# Altium schematic sheet Osiris.SchDoc
size A3
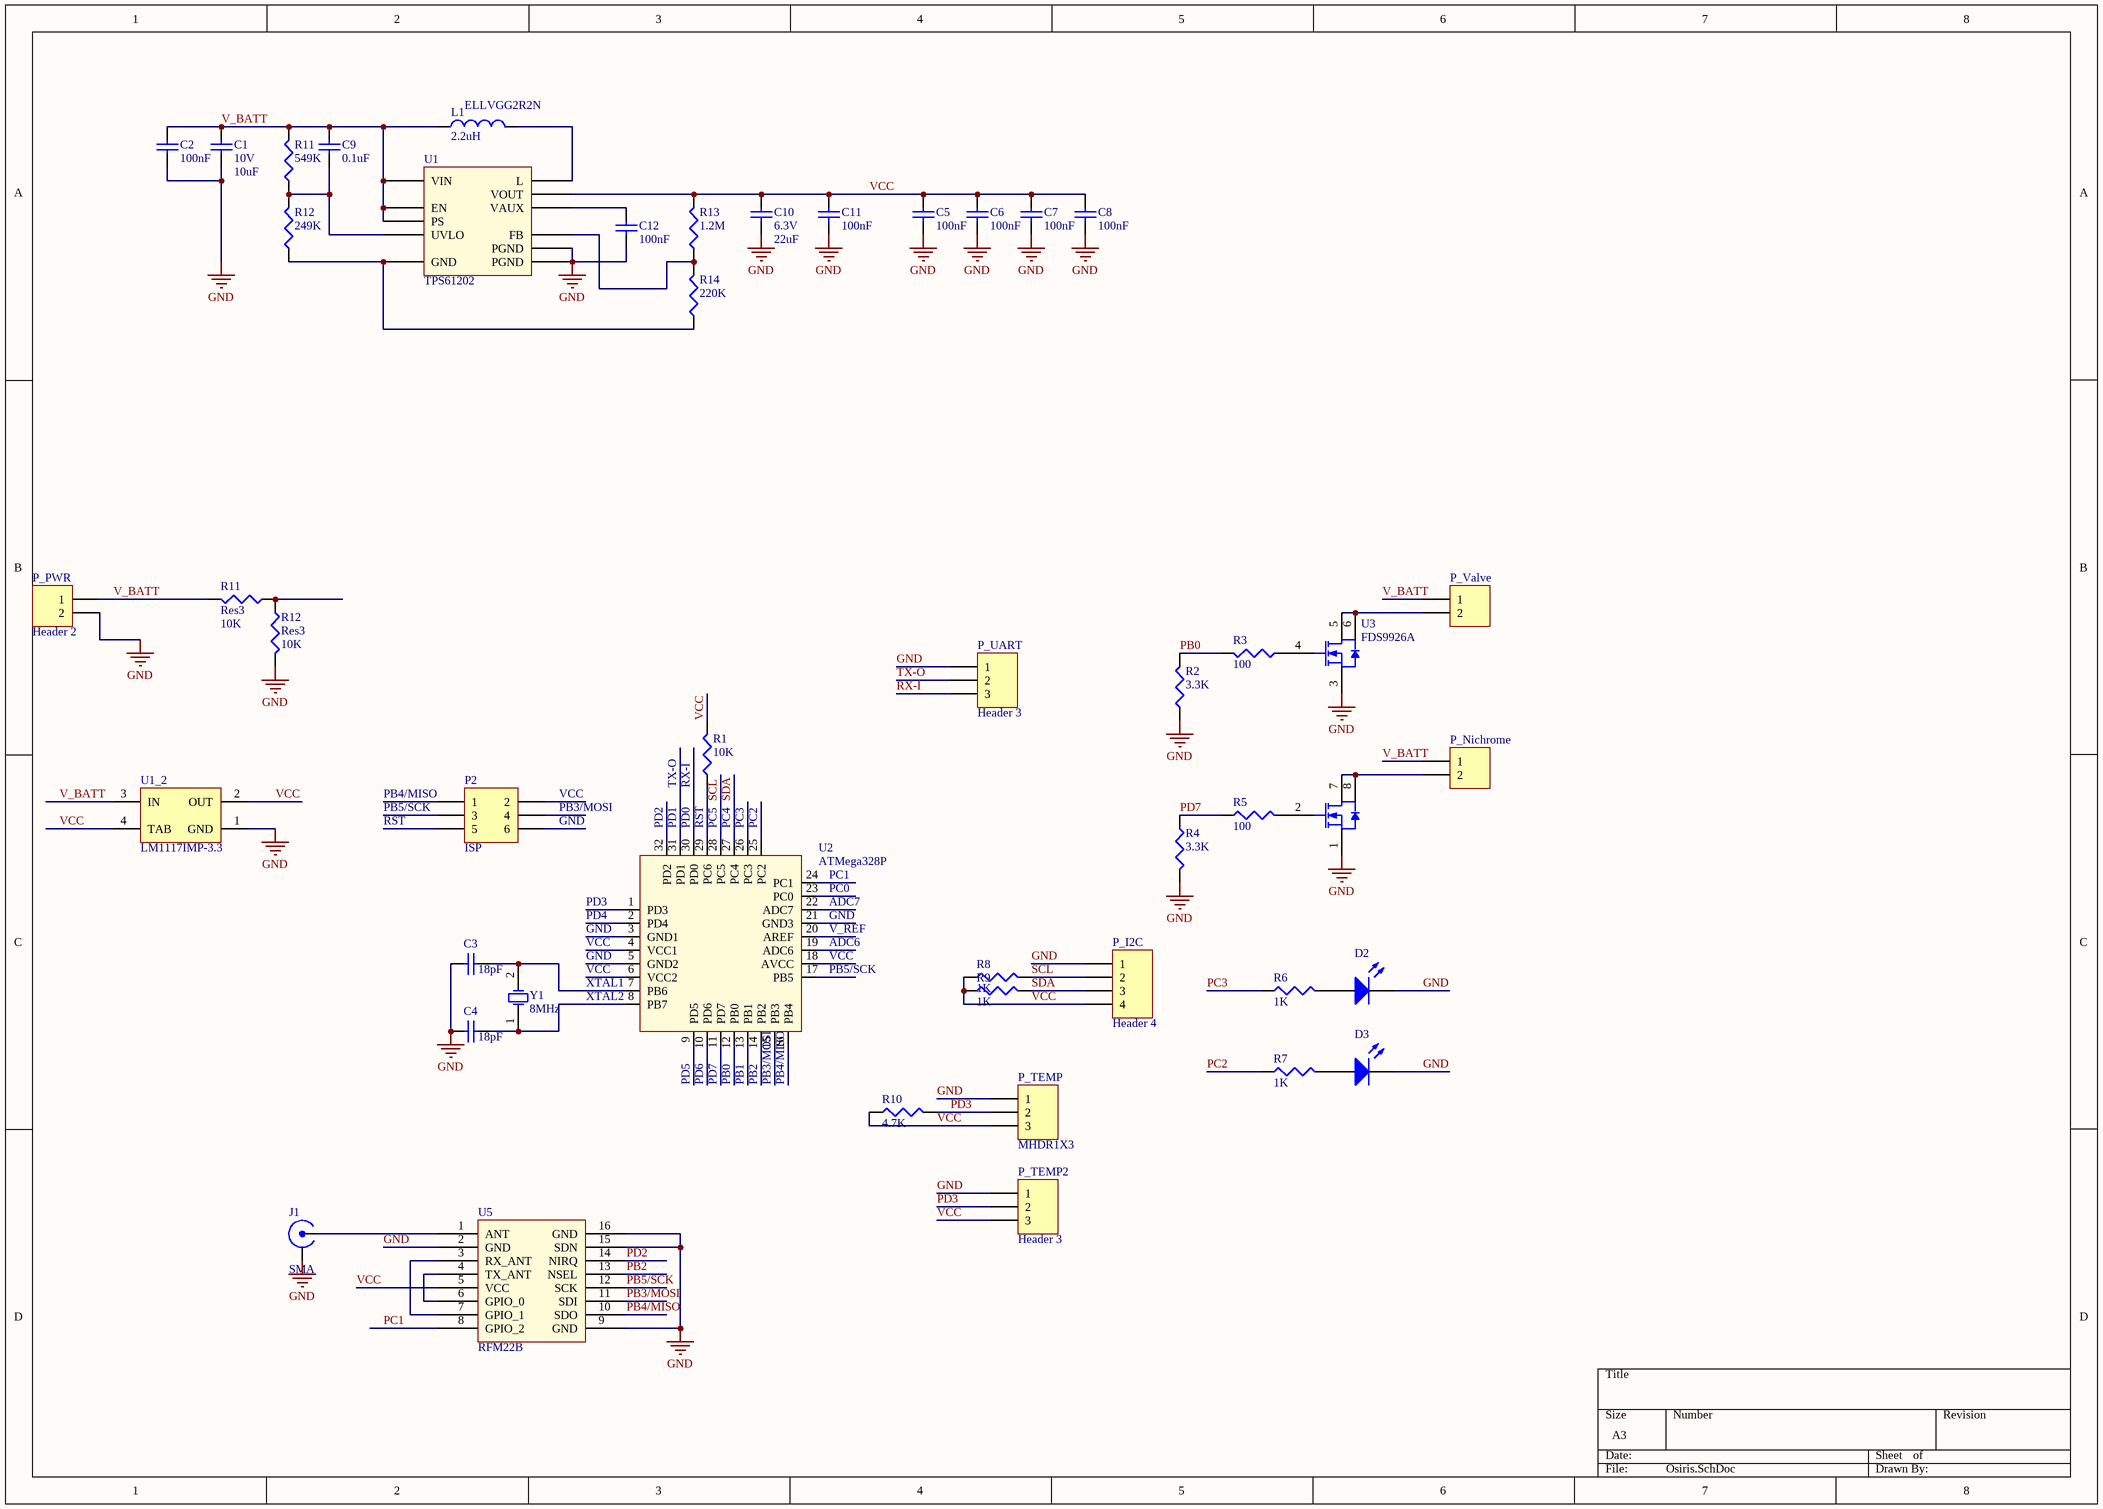
[diagram p0: Osiris.SchDoc]

## Parts
(Parts that share a designator on the sheet are numbered #1, #2 ... from top to bottom, then left to right.)
C1  10V  value 10uF  [C1206]
C2  value 100nF  [1608[0603]]  (hidden comment: Cap Semi)
C3  value 18pF  [1608[0603]]  (hidden comment: C0805)
C4  value 18pF  [1608[0603]]  (hidden comment: C0805)
C5  value 100nF  [1608[0603]]  (hidden comment: Cap Semi)
C6  value 100nF  [1608[0603]]  (hidden comment: Cap Semi)
C7  value 100nF  [1608[0603]]  (hidden comment: Cap Semi)
C8  value 100nF  [1608[0603]]  (hidden comment: Cap Semi)
C9  value 0.1uF  [1608[0603]]  (hidden comment: Cap Semi)
C10  6.3V  value 22uF  [6-0805_N]
C11  value 100nF  [1608[0603]]  (hidden comment: Cap Semi)
C12  value 100nF  [1608[0603]]  (hidden comment: Cap Semi)
D2  LED0  [6-0805_M]  (value not drawn)
D3  LED0  [6-0805_M]  (value not drawn)
J1  value SMA  [CON SMA PCB 90]  (hidden comment: SMA_R)
L1  ELLVGG2R2N  value 2.2uH  [ELLVGG]
P2  ISP  [HDR2X3]
P_I2C  Header 4  [HDR1X4]
P_Nichrome  Header 2  [HDR1X2]  (value not drawn)
P_PWR  Header 2  [HDR1X2]
P_TEMP  MHDR1X3  [MHDR1X3]
P_TEMP2  Header 3  [HDR1X3]
P_UART  Header 3  [HDR1X3]
P_Valve  Header 2  [HDR1X2]  (value not drawn)
R1  value 10K  [1608[0603]]  (hidden comment: Res3)
R2  value 3.3K  [1608[0603]]  (hidden comment: Res3)
R3  value 100  [1608[0603]]  (hidden comment: Res3)
R4  value 3.3K  [1608[0603]]  (hidden comment: Res3)
R5  value 100  [1608[0603]]  (hidden comment: Res3)
R6  value 1K  [J1-0603]  (hidden comment: Res3)
R7  value 1K  [J1-0603]  (hidden comment: Res3)
R8  value 1K  [J1-0603]  (hidden comment: Res3)
R9  value 1K  [J1-0603]  (hidden comment: Res3)
R10  value 4.7K  [J1-0603]  (hidden comment: Res3)
R11#1  value 549K  [J1-0603]  (hidden comment: Res3)
R11#2  Res3  value 10K  [J1-0603]
R12#1  value 249K  [J1-0603]  (hidden comment: Res3)
R12#2  Res3  value 10K  [J1-0603]
R13  value 1.2M  [1608[0603]]  (hidden comment: Res3)
R14  value 220K  [1608[0603]]  (hidden comment: Res3)
U1  TPS61202  [TPS61200]
U1_2  LM1117IMP-3.3  [MP04A_N]
U2  ATMega328P  [TQFP32]
U3  FDS9926A  [SO8_M]
U5  RFM22B  [RFM22B]
Y1  8MHz  [ABM3_XTAL]

## Nets
GND: C1.1 C2.1 C3.1 C4.1 C5.1 C6.1 C7.1 C8.1 C10.1 C11.1 C12.1 D2.2(K) D3.2(K) J1.2 P2.6 P_I2C.1 P_PWR.2 P_TEMP.1 P_TEMP2.1 P_UART.1 R2.1 R4.2 R12#2.2 U1.0(PGND) U1.4(PGND) U1_2.1(GND) U2.3(GND1) U2.5(GND2) U2.21(GND3) U3.1(S) U3.3(S) U5.2(GND) U5.9(GND) U5.15(SDN) U5.16(GND)
ADC6: U2.19(ADC6)
ADC7: U2.22(ADC7)
PB0: R2.2 R3.2 U2.12(PB0)
PB1: U2.13(PB1)
PB2: U2.14(PB2) U5.13(NSEL)
PB3/MOSI: P2.4 U2.15(PB3) U5.11(SDI)
PB4/MISO: P2.1 U2.16(PB4) U5.10(SDO)
PB5/SCK: P2.3 U2.17(PB5) U5.12(SCK)
PC0: U2.23(PC0)
PC1: U2.24(PC1) U5.8(GPIO_2)
PC2: R7.1 U2.25(PC2)
PC3: R6.1 U2.26(PC3)
PC4: P_I2C.3 R9.2 U2.27(PC4)  [also labelled SDA]
PC5: P_I2C.2 R8.2 U2.28(PC5)  [also labelled SCL]
PD0: P_UART.3 U2.30(PD0)  [also labelled RX-I]
PD1: P_UART.2 U2.31(PD1)  [also labelled TX-O]
PD2: U2.32(PD2) U5.14(NIRQ)
PD3: P_TEMP.2 P_TEMP2.2 R10.2 U2.1(PD3)
PD4: U2.2(PD4)
PD5: U2.9(PD5)
PD6: U2.10(PD6)
PD7: R4.1 R5.1 U2.11(PD7)
RST: P2.5 R1.1 U2.29(PC6)
V_BATT: C1.2 C2.2 C9.2 L1.1 P_Nichrome.1 P_PWR.1 P_Valve.1 R11#1.2 R11#2.2 U1.5(VIN) U1.6(EN) U1.8(PS) U1_2.3(IN)
V_REF: U2.20(AREF)
VCC: C5.2 C6.2 C7.2 C8.2 C10.2 C11.2 P2.2 P_I2C.4 P_TEMP.3 P_TEMP2.3 R1.2 R8.1 R9.1 R10.1 R13.2 U1.2(VOUT) U1_2.2(OUT) U1_2.4(TAB) U2.4(VCC1) U2.6(VCC2) U2.18(AVCC) U5.5(VCC)
XTAL1: C3.2 U2.7(PB6) Y1.2(OSC2)
XTAL2: C4.2 U2.8(PB7) Y1.1(OSC1)
NetC9_1: C9.1 R11#1.1 R12#1.2 U1.7(UVLO)
NetC12_2: C12.2 U1.1(VAUX)
NetD2_1: D2.1(A) R6.2
NetD3_1: D3.1(A) R7.2
NetJ1_1: J1.1 U5.1(ANT)
NetL1_2: L1.2 U1.3(L)
NetP_Nichrome_2: P_Nichrome.2 U3.7(D) U3.8(D)
NetP_Valve_2: P_Valve.2 U3.5(D) U3.6(D)
NetR3_1: R3.1 U3.4(G)
NetR5_2: R5.2 U3.2(G)
NetR11#2_1: R11#2.1 R12#2.1
NetR12#1_1: R12#1.1 R14.1 U1.9(GND)
NetR13_1: R13.1 R14.2 U1.10(FB)
NetU5_3: U5.3(RX_ANT) U5.7(GPIO_1)
NetU5_4: U5.4(TX_ANT) U5.6(GPIO_0)

## Library data of the parts
C1 C2 C5-C12 = Cap Semi: Capacitor (Semiconductor SIM Model); Published: 8-Jun-2000; LatestRevisionDate: 29-May-2009; LatestRevisionNote: IPC-7351 Footprint Added.; PackageReference: C1206; Publisher: Altium Limited; PackageDescription: Chip Capacitor
C3 C4 = C0805: Ceramic Chip Capacitor - Standard; Note: Footprint corresponds to dimensions for bulk cassette packaging. This case size has tightened tolerances.; Published: 17-Jul-2002; LatestRevisionDate: 19-Mar-2004; LatestRevisionNote: Silkscreen size reduced.; DatasheetDocument: Mar-2001; PackageDocument: Mar-2001; PackageReference: 0805; Publisher: Altium Limited; Code_JEITA: 0805; Code_IPC: 2012[0805]; ComponentLink1Description: Manufacturer Link; ComponentLink1URL: http://www.kemet.com/; ComponentLink2Description: Datasheet; ComponentLink2URL: http://www.kemet.com/kemet/web/homepage/kechome.nsf/vapubfilesname/F3102TA.pdf/$file/F3102TA.pdf
D2 D3 = LED0: Typical INFRARED GaAs LED; Published: 8-Jun-2000; LatestRevisionDate: 08-Jul-2005; LatestRevisionNote: Mech Layer 1 removed.; PackageReference: LED-0; Publisher: Altium Limited; PackageDescription: LED; 2 Leads
J1 = SMA_R: Power Connector
L1 = Inductor: Code_IEC: 1005; Published: 8-Jun-2000; LatestRevisionDate: 29-May-2009; LatestRevisionNote: IPC-7351 Footprint Added.; PackageReference: 0402-A; Publisher: Altium Limited; PackageDescription: Chip Inductor; Code_JEITA: 0402
P2 = Header 3X2: Header, 3-Pin, Dual row; LatestRevisionDate: 17-Jul-2002; LatestRevisionNote: Re-released for DXP Platform.; Publisher: Altium Limited
P_I2C = Header 4: Header, 4-Pin; LatestRevisionDate: 17-Jul-2002; LatestRevisionNote: Re-released for DXP Platform.; Publisher: Altium Limited
P_Nichrome P_PWR P_Valve = Header 2: Header, 2-Pin; LatestRevisionDate: 17-Jul-2002; LatestRevisionNote: Re-released for DXP Platform.; Publisher: Altium Limited
P_TEMP = MHDR1X3: Header, 3-Pin; LatestRevisionDate: 17-Jul-2002; LatestRevisionNote: Re-released for DXP Platform.; Publisher: Altium Limited
P_TEMP2 P_UART = Header 3: Header, 3-Pin; LatestRevisionDate: 17-Jul-2002; LatestRevisionNote: Re-released for DXP Platform.; Publisher: Altium Limited
R1-R10 R11#1 R11#2 R12#1 R12#2 R13 R14 = Res3: Resistor; Published: 8-Jun-2000; LatestRevisionDate: 29-May-2009; LatestRevisionNote: IPC-7351 Footprint Added.; PackageReference: J1-0603; Publisher: Altium Limited; PackageDescription: Chip Resistor
U1 = TPS61200
U1_2 = LM1117IMP-3.3: 800mA Low-Dropout Linear Regulator, 4-pin SOT-223; Manufacturer: National Semiconductor; PackageTopMarking: XYTT*N05B; PowerWise: N; CompType: LDO IC; Published: 4-Dec-2008; DatasheetVersion: Apr-2006; PackageVersion: revB, Apr-2003; PackageReference: MP04A; Publisher: Altium Limited; PackageDescription: Molded SOT-223, 6.50 x 3.56 x 1.6mm Body, 4 Lead, 2.3mm Pitch; Supplier 1: Farnell; Supplier Part Number 1: 7614123; PartNumber: LM1117IMP-3.3; RoHS: N; PinCount: 4; Code_JEDEC: TO-261-AA; Code_IPC: SOT223-4; ComponentLink1Description: LM1117 Datasheet; ComponentLink1URL: http://www.national.com/ds/LM/LM1117.pdf; ComponentLink2Description: LM1117 Web Page; ComponentLink2URL: http://www.national.com/pf/LM/LM1117.html; ComponentLink3Description: MP04A Package Page; ComponentLink3URL: http://www.national.com/packaging/folders/mp04a.html
U5 = RFM22B-S2
Y1 = ECS-110-S-1: Crystal Oscillator; Published: 17-Jul-2002; DatasheetDocument: 18-Apr-2000; PackageReference: HC-49U; Publisher: Altium Limited; ComponentLink1Description: Manufacturer Link; ComponentLink1URL: http://www.ecsxtal.com/; ComponentLink2Description: Datasheet; ComponentLink2URL: http://www.ecsxtal.com/pdf2/HC49U.PDF